# Altium schematic sheet SD_Card.SchDoc
size A; SheetNumber: 8; SheetTotal: 9
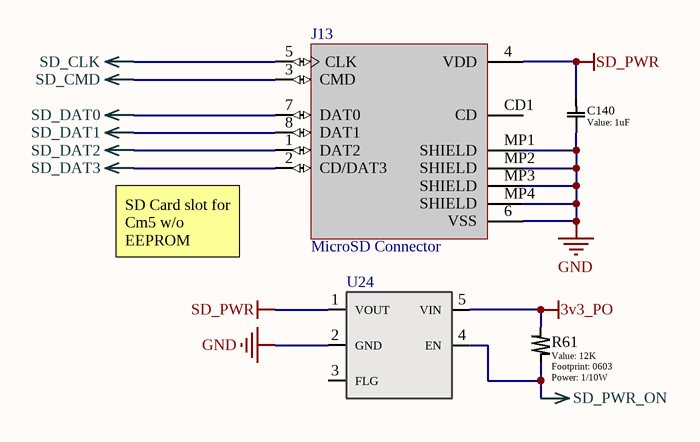
[diagram p0: SD_Card.SchDoc]

## Parts
C140  value 1uF  [0603]  (hidden comment: Generic Capacitor)
J13  MicroSD Connector  [TF-01A - NoCut]
R61  value 12K  Power: 1/10W  [0603]  (hidden comment: Generic Resistor)
U24  (no value)  [TSOT-23-5]

## Nets
3v3_PO: R61.1 U24.5(VIN)
GND: C140.1 J13.6(VSS) J13.MP1(SHIELD) J13.MP2(SHIELD) J13.MP3(SHIELD) J13.MP4(SHIELD) U24.2(GND)
SD_CLK: J13.5(CLK)
SD_CMD: J13.3(CMD)
SD_DAT0: J13.7(DAT0)
SD_DAT1: J13.8(DAT1)
SD_DAT2: J13.1(DAT2)
SD_DAT3: J13.2(CD/DAT3)
SD_PWR: C140.2 J13.4(VDD) U24.1(VOUT)
SD_PWR_ON: R61.2 U24.4(EN)

Not connected (* = marked no-connect by the designer): J13 CD1(CD); U24 3(FLG)

## Notes on the sheet
- SD Card slot for Cm5 w/o EEPROM
- REV
- REVISIONS
- DATE
- DESCRIPTION
- BY
- UNLESS OTHERWISE SPECIFIED, DRAWING DEFINITIONS AND TOLERANCES SHALL BE FOUND UNDER SUPPLIER STANDARDS SS-001. THIS PART AND ALL COMPONENTS OF IT MUST BE RoHS & REACH COMPLIANT. A CERTIFICATE OF COMPLIANCE MUST BE PROVIDED UPON REQUEST.
- ALL INFORMATION ON THIS DOCUMENT IS THE SOLE PROPERTY OF GAMBER-JOHNSON AND SHALL NOT BE COPIED, REPRODUCED, USED OR DISCLOSED IN WHOLE OR IN PART WITHOUT THE WRITTEN CONSENT OF GAMBER-JOHNSON
- TOLERANCES
  .00 ± .060
  .000 ± .020
  .0000 ± .005
  ANGELS ± 1°
- DRAWN BY:
- PROJECT NUMBER:
- SHEET TITLE:
- SHEET
- OF
- DATE:
- LOCATION:
- ASSEMBLY NUMBER
- SIZE
- GAMBER-JOHNSON LLC
  5001 Joerns Dr
  STEVENS POINT, WI 54481
  +1 (715) 344-5209
- A

## Library data of the parts
C140 = Generic Capacitor: Voltage: 6V; Tolerance: 5%
J13 = TF-01A: Deck MicroSD card (TF card) Self bomb SMD SD Card Connector; LCSC PN: C91145
R61 = Generic Resistor: Tolerance: 1%
U24 = RT9742GGJ5: Power Switch/Driver 1:1 N-Channel 1A TSOT-23-5; Mfr_Name: Richtek Technology; RefDes: RefDes; Type: Type; LCSC PN: C250547